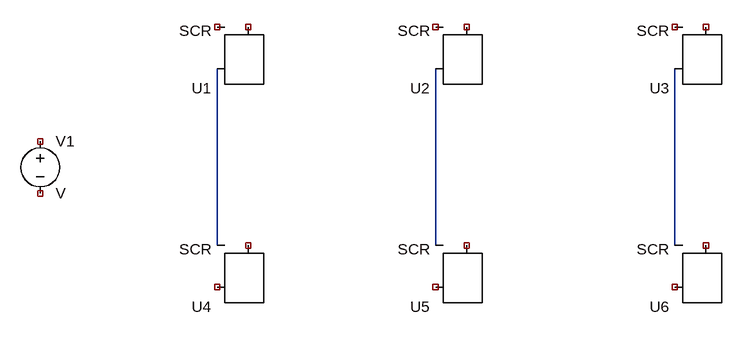
[diagram p0: schematic Circuito rectificador trifásico totalmente controlado.asc]
Circuito rectificador trifásico totalmente controlado.asc, the LTspice schematic file:
Version 4
SHEET 1 880 680
WIRE -240 352 -240 80
WIRE 96 352 96 80
WIRE 464 352 464 80
SYMBOL voltage -512 176 R0
SYMATTR InstName V1
SYMBOL Misc\\SCR -224 80 R180
SYMATTR InstName U1
SYMBOL Misc\\SCR 112 80 R180
SYMATTR InstName U2
SYMBOL Misc\\SCR 480 80 R180
SYMATTR InstName U3
SYMBOL Misc\\SCR -224 416 R180
SYMATTR InstName U4
SYMBOL Misc\\SCR 112 416 R180
SYMATTR InstName U5
SYMBOL Misc\\SCR 480 416 R180
SYMATTR InstName U6

The netlist it stands for:
* Circuito rectificador trifásico totalmente controlado.asc
V1 NC_01 NC_02 V
* U1: SCR (symbol Misc\SCR not certain, pin order unknown); nets seen at it: N001
* U2: SCR (symbol Misc\SCR not certain, pin order unknown); nets seen at it: N002
* U3: SCR (symbol Misc\SCR not certain, pin order unknown); nets seen at it: N003
* U4: SCR (symbol Misc\SCR not certain, pin order unknown); nets seen at it: N001
* U5: SCR (symbol Misc\SCR not certain, pin order unknown); nets seen at it: N002
* U6: SCR (symbol Misc\SCR not certain, pin order unknown); nets seen at it: N003
.backanno
.end